# EAGLE design power (EAGLE 9.6.2)
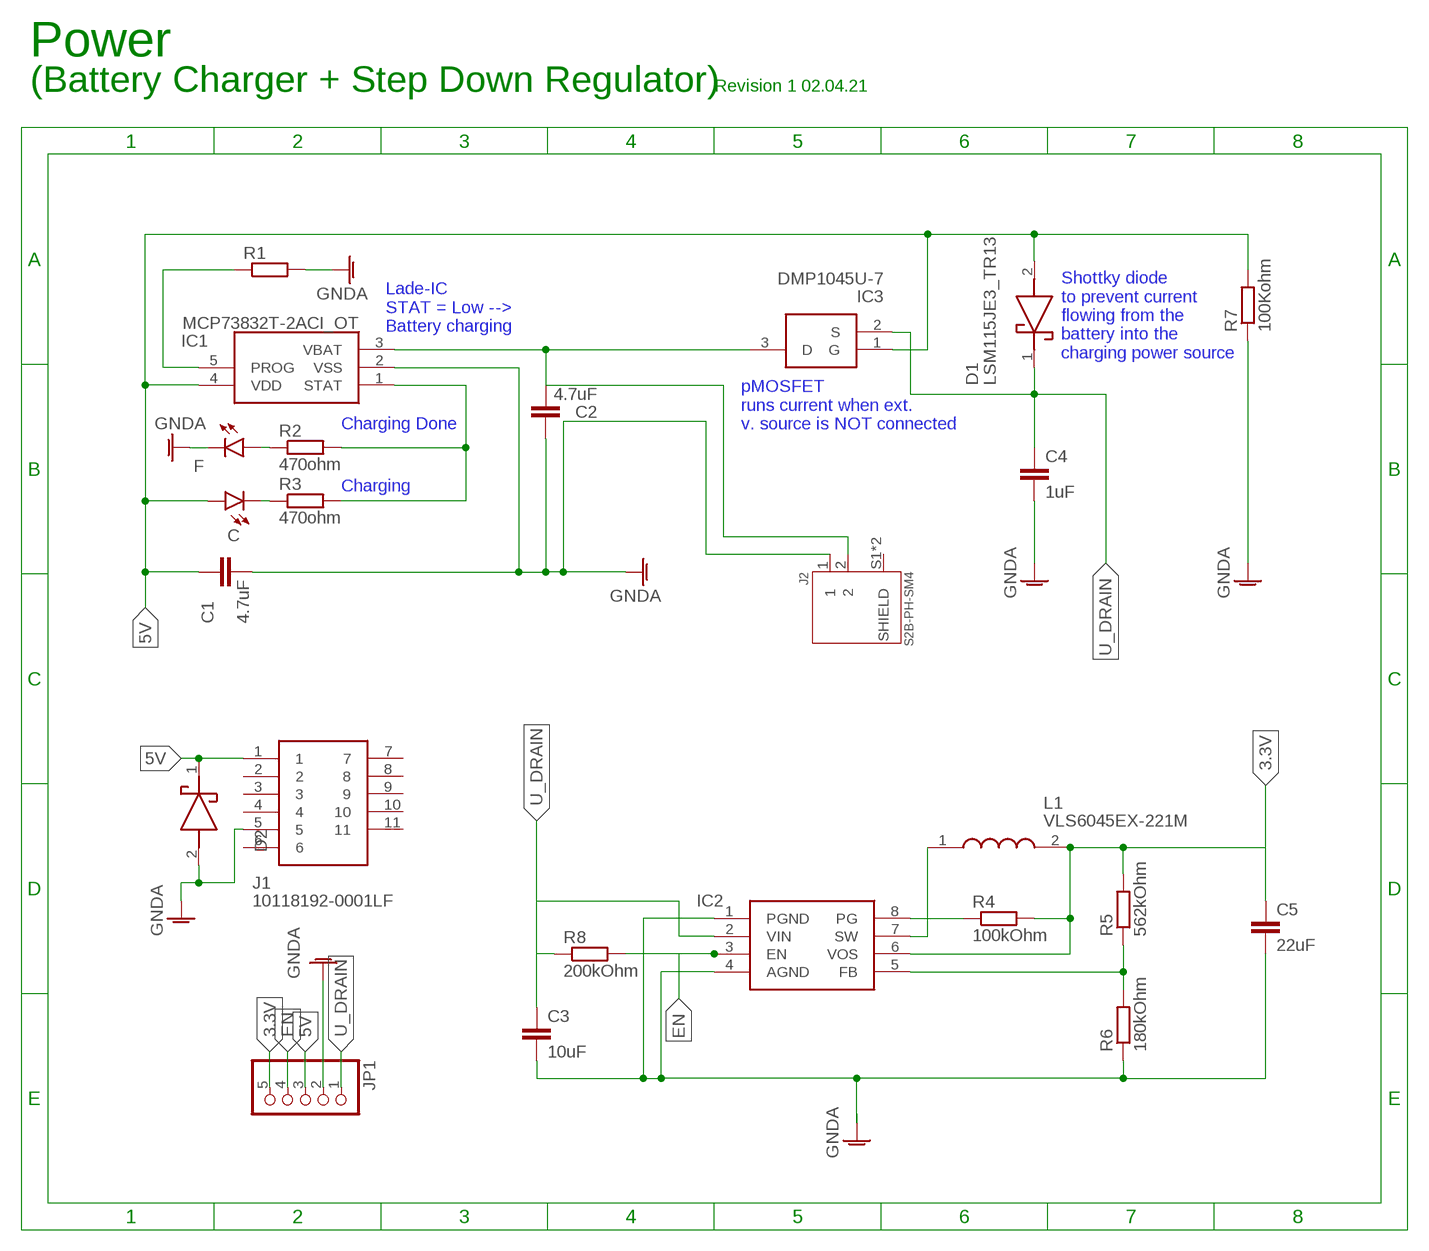
[diagram p0: schematic, sheet 1]

## Parts
C  LED_1206SMT1206  [1206]
C1  4.7uF  C-EU_1206C1206  [C1206]
C2  4.7uF  C-EU_1206C1206  [C1206]
C3  10uF  CNC5L1X7R1C106K160AEC1206  [C1206]
C4  1uF  C-EU_805C0805  [C0805]
C5  22uF  GRM219R61C226ME15KC0805K  [C0805K]
D1  LSM115JE3_TR13  [DIOM5436X330N]
D2  LSM115JE3_TR13  [DIOM5436X330N]
F  LED_1206SMT1206  [1206]
IC1  MCP73832T-2ACI_OT  [SOT95P270X145-5N]
IC2  TPS62160DGKR  [SOP65P490X110-8N]
IC3  DMP1045U-7  [SOT96P240X100-3N]
J1  10118192-0001LF  [101181920001LF]
J2  S2B-PH-SM4  [JST_S2B-PH-SM4-TB(LF)(SN)]
JP1  PINHD-1X5  [1X05]
L1  VLS6045EX-221M  [INDPM6060X450N]
R1  R-EU_805R0805  [R0805]
R2  470ohm  R-EU_805R0805  [R0805]
R3  470ohm  R-EU_805R0805  [R0805]
R4  100kOhm  R-EU_805R0805  [R0805]
R5  562kOhm  R-EU_805R0805  [R0805]
R6  180kOhm  R-EU_805R0805  [R0805]
R7  100Kohm  R-EU_805R0805  [R0805]
R8  200kOhm  R-EU_805R0805  [R0805]

## Nets
3.3V: C5.1 IC2.6(VOS) JP1.5 L1.2 R4.2 R5.2
5V: C1.1 C.A D1.2(A) D2.1(K) IC1.4(VDD) IC3.1(G) J1.1 JP1.3 R7.2
EN: IC2.3(EN) JP1.4 R8.2
FB: IC2.5(FB) R5.1 R6.2
GNDA: C1.2 C2.1 C3.2 C4.2 C5.2 D2.2(A) F.C IC1.2(VSS) IC2.1(PGND) IC2.4(AGND) J1.5 J2.1 JP1.2 R1.2 R6.1 R7.1
N$1: IC1.5(PROG) R1.1
N$3: F.A R2.1
N$10: C.C R3.1
PG: IC2.8(PG) R4.1
STAT: IC1.1(STAT) R2.2 R3.2
SW: IC2.7(SW) L1.1
U_DRAIN: C3.1 C4.1 D1.1(K) IC2.2(VIN) IC3.2(S) JP1.1 R8.1
VBAT: C2.2 IC1.3(VBAT) IC3.3(D) J2.2
Unconnected: J1.2 J1.3 J1.4 J1.6 J1.7 J1.8 J1.9 J1.10 J1.11 J2.S1(SHIELD) J2.S2(SHIELD)

## Notes on the sheet
- Power
- (Battery Charger + Step Down Regulator) | Revision 1 02.04.21
- Lade-IC
  STAT = Low -->
  Battery charging
- Shottky diode
  to prevent current 
  flowing from the 
  battery into the 
  charging power source
- Charging Done
- pMOSFET
  runs current when ext. 
  v. source is NOT connected
- Charging

## Library data of the parts
C F = CommonParts:LED_1206: LED OSRAM: - CHIPLED LG R971, LG N971, LY N971, LG Q971, LY Q971, LO R971, LY R971 LH N974, LH R974 LS Q976, LO Q976, LY Q976 LO Q996 - Hyper CHIPLED LW Q18S LB Q993, LB Q99A, LB R99A - SideLED LS A670, LO A670, LY A670, LG A670, LP A670 LB A673, LV A673, LT A673, LW A673 LH A674 LY A675 LS A676, LA A676, LO A676, LY A676, LW A676 LS A679, LY A679, LG A679 - Hyper Micro SIDELED® LS Y876, LA Y876, LO Y876, LY Y876 LT Y87S - SmartLED LW L88C, LW L88S LB L89C, LB L89S, LG L890 LS L89K, LO L89K, LY L89K LS L896, LA L896, LO L896, LY L896 - TOPLED LS T670, LO T670, LY T670, LG T670, LP T670 LSG T670, LSP T670, LSY T670, LOP T670, LYG T670 LG T671, LOG T671, LSG T671 LB T673, LV T673, LT T673, LW T673 LH T674 LS T676, LA T676, LO T676, LY T676, LB T676, LH T676, LSB T676, LW T676 LB T67C, LV T67C, LT T67C, LS T67K, LO T67K, LY T67K, LW E67C LS E67B, LA E67B, LO E67B, LY E67B, LB E67C, LV E67C, LT E67C LW T67C LS T679, LY T679, LG T679 LS T770, LO T770, LY T770, LG T770, LP T770 LB T773, LV T773, LT T773, LW T773 LH T774 LS E675, LA E675, LY E675, LS T675 LS T776, LA T776, LO T776, LY T776, LB T776 LHGB T686 LT T68C, LB T68C - Hyper Mini TOPLED® LB M676 - Mini TOPLED Santana® LG M470 LS M47K, LO M47K, LY M47K Source: http://www.osram.convergy.de LUXEON: - LUMILED® LXK2-PW12-R00, LXK2-PW12-S00, LXK2-PW14-U00, LXK2-PW14-V00 LXK2-PM12-R00, LXK2-PM12-S00, LXK2-PM14-U00 LXK2-PE12-Q00, LXK2-PE12-R00, LXK2-PE12-S00, LXK2-PE14-T00, LXK2-PE14-U00 LXK2-PB12-K00, LXK2-PB12-L00, LXK2-PB12-M00, LXK2-PB14-N00, LXK2-PB14-P00, LXK2-PB14-Q00 LXK2-PR12-L00, LXK2-PR12-M00, LXK2-PR14-Q00, LXK2-PR14-R00 LXK2-PD12-Q00, LXK2-PD12-R00, LXK2-PD12-S00 LXK2-PH12-R00, LXK2-PH12-S00 LXK2-PL12-P00, LXK2-PL12-Q00, LXK2-PL12-R00 Source: www.luxeon.com KINGBRIGHT: KA-3528ASYC Source: www.kingbright.com
C1 C2 = CommonParts:C-EU_1206: CAPACITOR, European symbol; SPICEPREFIX: C
C3 = MouserUseful:CNC5L1X7R1C106K160AE: CAPACITOR, European symbol; MAX: 16V; SPICEPREFIX: C
C4 = CommonParts:C-EU_805: CAPACITOR, European symbol; SPICEPREFIX: C
C5 = MouserUseful:GRM219R61C226ME15K: CAPACITOR, European symbol; MAXV: 16V; SPICEPREFIX: C
D1 D2 = CommonParts:LSM115JE3_TR13: Schottky Diodes & Rectifiers Schottky Source: Datasheet <https://componentsearchengine.com/Datasheets/1/LSM115JE3_TR13.pdf>; DESCRIPTION: Schottky Diodes & Rectifiers Schottky; HEIGHT: 3.3mm; MANUFACTURER_NAME: Microsemi Corporation; MANUFACTURER_PART_NUMBER: LSM115JE3/TR13; MOUSER_PART_NUMBER: 494-LSM115JE3/TR13; MOUSER_PRICE-STOCK: https://www.mouser.com/Search/Refine.aspx?Keyword=494-LSM115JE3%2FTR13
IC1 = MouserUseful:MCP73832T-2ACI_OT: Battery Charger Lithium-Ion, Lithium-Polymer Source: Datasheet <https://componentsearchengine.com/Datasheets/1/MCP73832T-2ACI_OT.pdf>; DESCRIPTION: Battery Charger Lithium-Ion, Lithium-Polymer; HEIGHT: 1.45mm; MANUFACTURER_NAME: Microchip; MANUFACTURER_PART_NUMBER: MCP73832T-2ACI/OT; MOUSER_PART_NUMBER: 579-MCP73832T-2ACIOT; MOUSER_PRICE-STOCK: https://www.mouser.com/Search/Refine.aspx?Keyword=579-MCP73832T-2ACIOT
IC2 = MouserUseful:TPS62160DGKR: Switching Voltage Regulators 3V-17V 1A Step-Down Converter Source: Datasheet <http://www.ti.com/lit/ds/symlink/tps62160.pdf>; DESCRIPTION: Switching Voltage Regulators 3V-17V 1A Step-Down Converter; HEIGHT: 1.1mm; MANUFACTURER_NAME: Texas Instruments; MANUFACTURER_PART_NUMBER: TPS62160DGKR; MOUSER_PART_NUMBER: 595-TPS62160DGKR; MOUSER_PRICE-STOCK: https://www.mouser.com/Search/Refine.aspx?Keyword=595-TPS62160DGKR
IC3 = MouserUseful:DMP1045U-7: P-Channel Enhancement MOSFET SOT-23 Diodes Inc DMP1045U-7 P-channel MOSFET Transistor, 5.2 A, -12 V, 3-Pin SOT23 Source: Datasheet <https://componentsearchengine.com/Datasheets/1/DMP1045U-7.pdf>; DESCRIPTION: P-Channel Enhancement MOSFET SOT-23 Diodes Inc DMP1045U-7 P-channel MOSFET Transistor, 5.2 A, -12 V, 3-Pin SOT23; HEIGHT: 1mm; MANUFACTURER_NAME: Diodes Inc.; MANUFACTURER_PART_NUMBER: DMP1045U-7; MOUSER_PART_NUMBER: 621-DMP1045U-7; MOUSER_PRICE-STOCK: https://www.mouser.com/Search/Refine.aspx?Keyword=621-DMP1045U-7
J1 = MouserUseful:10118192-0001LF: USB Connectors 5P MICRO USB TYPE B RECEPTACLE Source: Datasheet <https://www.mouser.tw/datasheet/2/18/10118192-1361887.pdf>; DESCRIPTION: USB Connectors 5P MICRO USB TYPE B RECEPTACLE; HEIGHT: 2.8mm; MANUFACTURER_NAME: Amphenol; MANUFACTURER_PART_NUMBER: 10118192-0001LF; MOUSER_PART_NUMBER: 649-10118192-0001LF; MOUSER_PRICE-STOCK: https://www.mouser.co.uk/ProductDetail/Amphenol-FCI/10118192-0001LF?qs=Ywefl8B65e5bHFoQtIudZg%3D%3D
J2 = CommonParts:S2B-PH-SM4: PH Series 2 Position 2 mm Pitch Surface Mount Side Entry Shrouded Header; DESCRIPTION: PH Series 2 Position 2 mm Pitch Surface Mount Side Entry Shrouded Header; DIGI-KEY_PART_NUMBER: 455-1749-1-ND; DIGI-KEY_PURCHASE_URL: https://www.digikey.com/product-detail/en/jst-sales-america-inc/S2B-PH-SM4-TB_LF__SN_/455-1749-1-ND/926846?utm_source=snapeda&utm_medium=aggregator&utm_campaign=symbol; MF: JST Sales; MP: S2B-PH-SM4-TB_LF__SN_; PACKAGE: None
JP1 = pinhead:PINHD-1X5: PIN HEADER
L1 = MouserUseful:VLS6045EX-221M: Wirewound Inductor 220uH 500mA 1.15 mOhm TDK VLS-EX Series Shielded Wire-wound SMD Inductor with a Ferrite Core, 220 uH Wire-Wound 500mA Idc Source: Datasheet <https://product.tdk.com/info/en/catalog/datasheets/inductor_commercial_power_vls6045ex_en.pdf>; DESCRIPTION: Wirewound Inductor 220uH 500mA 1.15 mOhm TDK VLS-EX Series Shielded Wire-wound SMD Inductor with a Ferrite Core, 220 uH Wire-Wound 500mA Idc; HEIGHT: 4.5mm; MANUFACTURER_NAME: TDK; MANUFACTURER_PART_NUMBER: VLS6045EX-221M; MOUSER_PART_NUMBER: 810-VLS6045EX-221M; MOUSER_PRICE-STOCK: https://www.mouser.com/Search/Refine.aspx?Keyword=810-VLS6045EX-221M; RS_PART_NUMBER: 1247062; RS_PRICE-STOCK: http://uk.rs-online.com/web/p/products/1247062
R1-R8 = CommonParts:R-EU_805: RESISTOR, European symbol

## Board
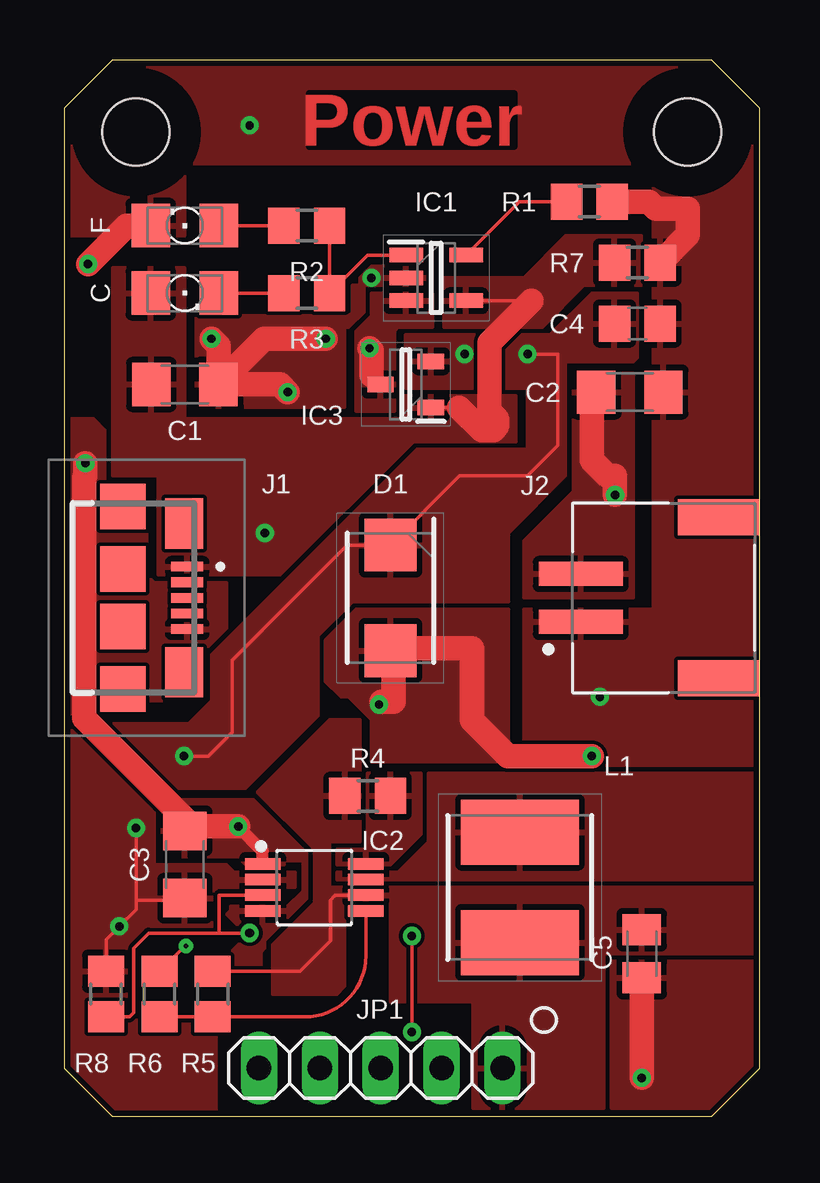
[diagram p1: board, top side]
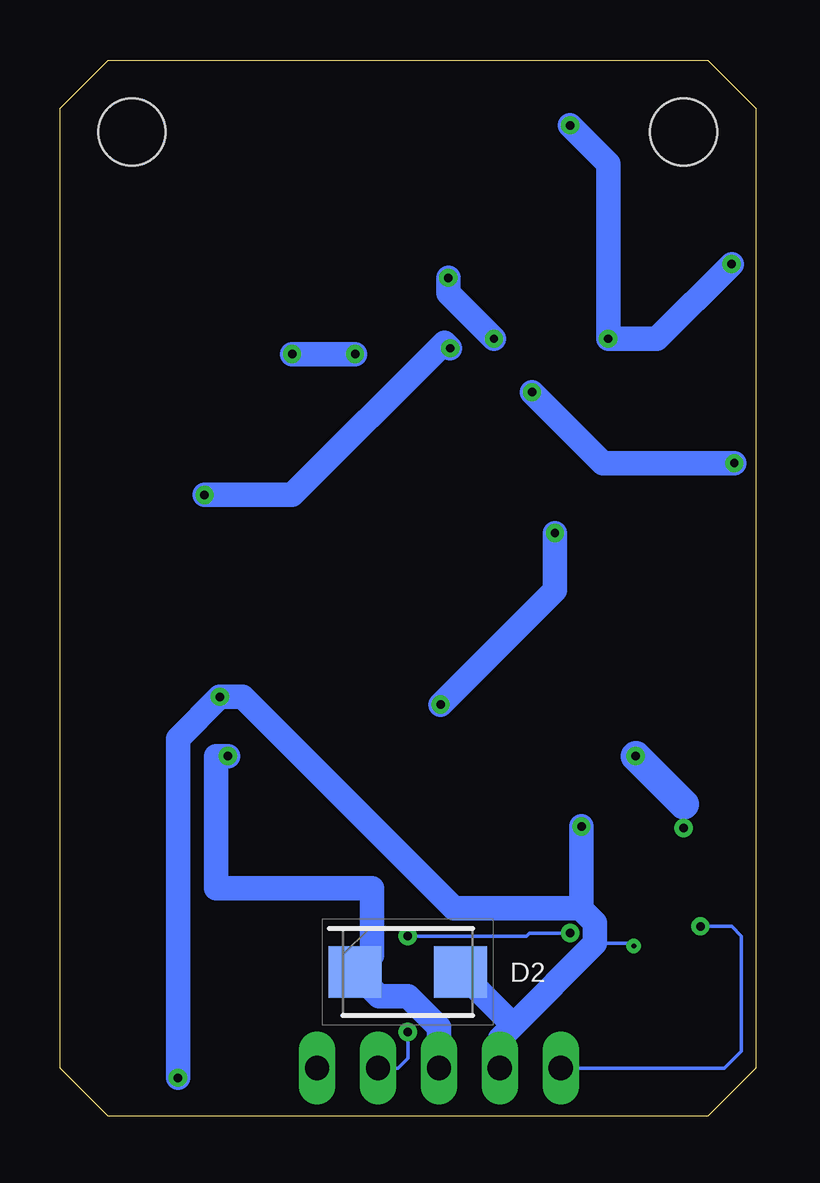
[diagram p2: board, bottom side, seen from below]

Size 29 x 44 mm. Coordinates in mm from the lower left corner, seen from the top.
Outline: 0,42 0,2 2,0 27,0 29,2 29,42 27,44 2,44 0,42
Copper layers (1*16): Top 0.035mm / dielectric 1.5mm / Bottom 0.035mm
Design rules "default *": minimum track width 6mil, minimum drill 0.35mm, track to track 6mil, track to pad 6mil, pad to pad 6mil, via to via 6mil, smd to smd 6mil, copper to edge 10mil, drill to drill 6mil, minimum pad ring 10mil, minimum via ring 8mil, stop-mask expansion 4mil, vias tented up to drill 0mil, thermal gap 10mil
Holes 2.8 mm at 3,41 26,41
tRestrict: area 24.6,39.6 to 27.4,42.4; area 24.6,39.6 to 27.4,42.4; area 1.6,39.6 to 4.4,42.4

### Footprints (pad centres in the part's own frame; a part is rotated, then mirrored left to right if it is on the bottom)
1206 = smd 1.6 x 1.803: A -1.422,0; C 1.422,0
C1206 = smd 1.6 x 1.8: 1 -1.4,0; 2 1.4,0
C0805 = smd 1.3 x 1.5: 1 -0.95,0; 2 0.95,0
C0805K = smd 1.3 x 1.6: 1 -1,0; 2 1,0
DIOM5436X330N = smd 2.2 x 2.15: 1 -2.2,0; 2 2.2,0
SOT95P270X145-5N = smd 1.4 x 0.6: 1 -1.25,0.95; 2 -1.25,0; 3 -1.25,-0.95; 4 1.25,-0.95; 5 1.25,0.95
SOP65P490X110-8N = smd 1.471 x 0.481: 1 -2.15,0.975; 2 -2.15,0.325; 3 -2.15,-0.325; 4 -2.15,-0.975; 5 2.15,-0.975; 6 2.15,-0.325; 7 2.15,0.325; 8 2.15,0.975
SOT96P240X100-3N = smd 1.1 x 0.65: 1 -1.05,0.96; 2 -1.05,-0.96; 3 1.05,0
101181920001LF = smd 0.4 x 1.35: 1 -1.3,1.682; 2 -0.65,1.682; 3 0,1.682; 4 0.65,1.682; 5 1.3,1.682 | smd 2.1 x 1.6: 6 -3.1,1.557; 7 3.1,1.557 | smd 1.9 x 1.9: 8 -1.2,-0.993; 9 1.2,-0.993; 10 -3.8,-0.993; 11 3.8,-0.993
JST_S2B-PH-SM4-TB(LF)(SN) = smd 1 x 3.5: 1 -1,0; 2 1,0 | smd 1.5 x 3.4: S1 -3.35,-5.75; S2 3.35,-5.75
1X05 = drill 1.016 long: 1 -5.08,0; 2 -2.54,0; 3 0,0; 4 2.54,0; 5 5.08,0
INDPM6060X450N = smd 2.7 x 4.9: 1 -2.3,0; 2 2.3,0
R0805 = smd 1.3 x 1.5: 1 -0.95,0; 2 0.95,0

### Placement (x,y rotation side)
C  5.03,34.29 0 top
C1  5.03,30.48 0 top
C2  23.58,30.16 180 top
C3  5.03,10.48 90 top
C4  23.9,33.02 0 top
C5  24.08,6.76 270 top
D1  13.61,21.59 270 top
D2  14.5,6 0 bottom
F  5.03,37.1 180 top
IC1  15.51,34.92 0 top
IC2  10.43,9.53 0 top
IC3  14.24,30.48 180 top
J1  3.45,21.59 270 top
J2  21.54,21.59 90 top
JP1  13.2,2 0 top
L1  19,9.53 270 top
R1  21.9,38.1 0 top
R2  10.11,37.1 0 top
R3  10.11,34.29 0 top
R4  12.65,13.34 180 top
R5  6.2,5.08 90 top
R6  3.97,5.08 270 top
R7  23.9,35.56 180 top
R8  1.75,5.08 270 top

### Tracks (layer width: path | path; a pad name or v marks a point on that pad's centre or on a via)
3.3V
  Top 0.152: R5.2 9.83,6.03 11.1,7.3 11.1,9 11.3,9.2 IC2.6
  pour Top: 11.06,9.53 29.62,9.53 29.62,6.76 22.5,6.76 22.5,0.32 17.04,0.32 17.04,4.76 13.61,4.76 13.61,8.89 11.7,8.89 11.7,5.4 11.38,5.08 8.68,5.08 8.68,7.14 10.43,8.89 10.43,11.11 8.05,13.49 11.06,16.51 12.34,16.51 12.34,11.43 11.06,11.43
5V  (via drill 0.35)
  Top 0.152: D1.2 13.61,17.62 13.24,17.26 v13.13,17.14 | IC3.1 16.47,29.52 | 19.48,33.98 IC1.4
  Top 1.016: 16.47,29.52 17.41,28.57 17.89,28.57 18.05,28.73 18.05,29.05 17.73,29.37 17.73,32.23 19.48,33.97 19.48,33.98 | 13.24,17.26 13.74,17.26 13.74,19.25 | D1.2 13.74,19.25 | v22,15 18.5,15 17,16.5 17,19.5 13.99,19.5 13.74,19.25
  Bottom 1.016: v13.13,17.14 8.37,21.91 v8.37,24.29 | v22,15 22.5,15 22.5,9.5 16,9.5 16,6.7 D2.1 15.7,5 14.5,5 13.2,3.7 JP1.3
  pour Top: 14.08,30 14.08,29.05 3.92,29.05 3.92,22.54 9,22.54 14.56,28.1 18.84,28.1 18.84,30
  pour Top: 5.03,29.05 5.03,35.35 2.02,35.35 2.02,26.67 3.92,26.67 3.92,29.05
  pour Top: 15.83,34.92 19.16,34.92 20.91,36.67 24.06,36.67 24.06,34.61 21.68,34.61 19.93,32.86 15.83,32.86
  pour Top: 12.18,21.11 18.53,21.11 18.53,14.76 12.81,14.76 12.81,16.51 11.86,17.46 11.54,17.46 10.91,18.1 10.91,19.84
EN  (via drill 0.35, 0.36)
  Top 0.152: 6.46,7.62 6.46,9.21 IC2.3 | 6.46,7.62 v7.73,7.62 | R8.2 2.73,4.13 2.9,4.3 2.9,7 3.52,7.62 6.46,7.62 | v14.5,3.5 v14.5,7.5
  Bottom 0.152: v7.73,7.62 9.43,7.62 9.55,7.5 v14.5,7.5 | 14.5,3.27 v14.5,3.5 14.5,2.4 14.9,2 JP1.4
FB
  Top 0.152: IC2.5 12.58,6.67 arc-90 10.04,4.13 R5.1 R6.2
GNDA  (via drill 0.2, 0.35)
  Top 0.152: R6.1 5.03,7.08 v5.08,7.08
  Top 0.508: IC2.1 8.28,11.04 v7.26,12.06
  Top 1.016: C1.2 8.34,32.38 v10.91,32.38 | C1.2 6.43,32.1 v6.14,32.38 | C1.2 9,30.48 v9.32,30.16 | v24.08,1.59 C5.2 | v0.89,27.2 0.89,26.66 0.84,26.61 0.84,16.57 5.03,12.38 | 5.03,12.38 C3.2 | v7.26,12.06 5.34,12.06 5.03,12.38 | R1.2 24.39,38.1 24.68,37.81 26,37.81 26,36.71 R7.1 | F.C 2.6,37.1 v1,35.5
  Bottom 0.152: 10.7,1.9 10.7,2.04 JP1.2 | v5.08,7.08 5.18,7.19 6.69,7.19
  Bottom 1.016: v10.91,32.38 12.81,34.29 v12.81,34.92 | v7.73,41.27 6.14,39.69 v6.14,32.38 4.12,32.38 v1,35.5 | v9.32,30.16 6.36,27.2 v0.89,27.2 | 7.26,8.62 6.69,8.05 6.69,7.19 10.09,3.79 | 7.26,8.62 v7.26,12.06 | 7.26,8.62 7.3,8.66 12.58,8.66 21.38,17.46 v22.34,17.46 24.08,15.72 v24.08,1.59 | 10.09,3.79 10.66,3.22 JP1.2 | D2.2 10.09,3.79
  pour Top: 19.16,21.11 24.56,21.11 25.19,20.48 25.19,15.88 25.19,15.08 24.72,14.61 19.16,14.61
  pour Top: 22.81,6.45 22.81,0.32 27.51,0.32 29.51,2.32 29.51,6.45
  pour Top: 4.08,13.18 4.08,10.79 7.26,10.79 7.57,10.48 9.16,10.48 9.16,10.64 9.95,10.64 9.95,9.37 9.32,8.73 6.94,8.73 6.94,8.57 6.78,8.41 7.26,7.94 8.05,7.94 6.68,6.57 6.68,5.08 8.21,5.08 8.21,6.83 8.37,6.99 8.37,7.3 10.11,9.05 10.11,10.95 7.89,13.18
  pour Top: 6.78,22.23 3.76,22.23 3.45,22.54 3.45,26.35 1.86,26.35 1.7,26.51 1.7,28.57 1.22,29.05 -0.05,29.05 -0.05,16.76 1.38,16.76 1.38,17.3 5.51,17.3 5.51,19.05 6.78,20.32
  pour Top: 5.51,33.34 5.51,29.53 11.7,29.53 11.7,33.34
  pour Top: 14.88,35.4 12.81,35.4 12.34,34.92 12.34,34.77 12.34,34.61 15.03,34.61 15.03,35.4
  pour Top: 12.49,34.61 12.49,33.5 11.86,32.86 11.7,32.86 11.7,33.34 11.86,33.34 12.02,33.5 12.02,34.61
  pour Top: 29.26,14.72 29.26,41.81 27.26,43.81 2.02,43.81 0.02,41.81 0.02,36.67 5.03,36.67 5.03,39.69 24.56,39.69 24.56,14.61 29.15,14.61
N$1
  Top 0.152: IC1.5 18.98,38.1 R1.1
N$3
  Top 0.152: F.A R2.1
N$10
  Top 0.152: C.C R3.1
PG
  pour Top: 11.38,10.48 13.61,10.48 14.88,11.75 14.88,14.29 12.65,14.29 12.65,11.11 11.38,11.11
STAT
  Top 0.152: R2.2 R3.2 12.65,35.88 IC1.1
SW
  pour Top: 11.38,9.84 29.62,9.84 29.62,14.29 15.19,14.29 15.19,11.43 13.92,10.16 11.38,10.16
U_DRAIN  (via drill 0.35)
  Top 0.152: v19.32,31.75 20.59,31.75 20.59,27.94 19.32,26.67 16.48,26.67 D1.1 11.79,23.79 7,19 7,16 6,15 v5,15 | v16.69,31.75 16.78,31.75 | v3,12 3,9 | 3,9 4.96,9 C3.1 | R8.1 1.75,7.35 v2.3,7.9 3,8.6 3,9
  Bottom 0.152: 3,13 v3,12 | JP1.1 1.3,2 0.6,2.7 0.6,7.5 1,7.9 v2.3,7.9
  Bottom 1.016: v19.32,31.75 v16.69,31.75
  Bottom 1.27: v5,15 3,13
  pour Top: 9.64,10.16 7.1,10.16 6.78,10.48 3.76,10.48 3.76,13.38 4.04,13.65 7.57,13.65 10.59,16.67 10.59,20 12.02,21.43 17.41,21.43 17.41,27.78 14.72,27.78 6.14,19.21 6.14,17.3 5.19,16.35 -0.14,16.35 -0.14,0.08 6.34,0.08 6.34,9.53 9.64,9.53
  pour Top: 17.41,27.78 19.32,27.78 19.32,30.32 14.24,30.32 14.24,32.54 20.25,32.54 22,34.29 23.9,34.29 23.9,31.59 23.74,31.43 20.91,31.43 20.91,26.67 18.53,24.29 18.53,21.43 17.41,21.43
VBAT  (via drill 0.35)
  Top 0.152: 12.81,30.86 IC3.3
  Top 1.016: C2.2 22,29.98 22,27.33 22.65,26.67 22.97,26.67 v22.97,25.88 | v12.73,31.99 12.81,31.91 12.81,30.86
  Bottom 1.016: v22.97,25.88 19.32,25.88 12.97,32.23 v12.73,31.99
  pour Top: 23.74,30.96 21.23,30.96 21.23,26.04 19.16,23.97 19.16,21.59 23.74,21.59
  pour Top: 12.81,34.29 15.35,34.29 15.35,32.86 13.92,32.86 13.76,32.7 13.76,30 13.76,29.37 12.18,29.37 12.18,32.7 12.81,33.34

### Text on the board
Top: Power
tStop: Power